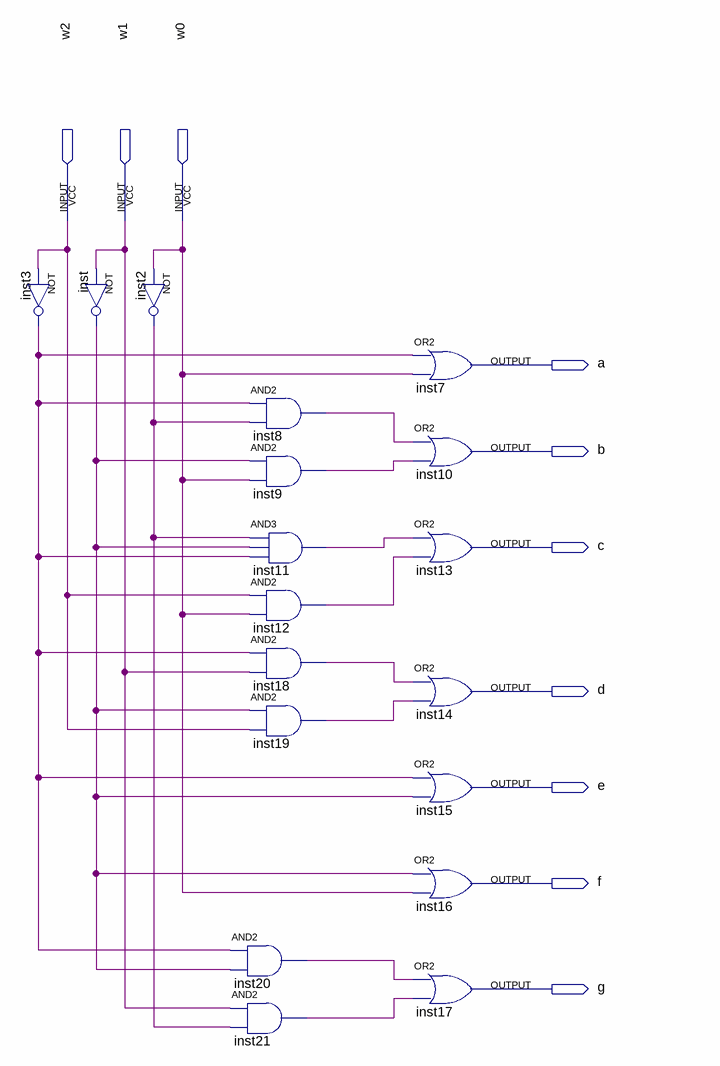
[diagram p0: schematic sheet]
// Quartus schematic WhatWonTo7Segment.bdf as structural Verilog: 18 symbols, 10 pins
module WhatWonTo7Segment (
  input  w2,
  input  w1,
  input  w0,
  output a,
  output b,
  output c,
  output d,
  output e,
  output f,
  output g
);

  wire inst2_out, inst3_out, inst8_out, inst9_out, inst11_out, inst12_out, inst18_out, inst19_out,
       inst20_out, inst21_out, inst_out;

  not inst3 (inst3_out, w2);
  not inst (inst_out, w1);
  not inst2 (inst2_out, w0);
  and inst8 (inst8_out, inst3_out, inst2_out);
  and inst9 (inst9_out, inst_out, w0);
  and inst11 (inst11_out, inst2_out, inst_out, inst3_out);
  and inst12 (inst12_out, w2, w0);
  and inst18 (inst18_out, inst3_out, w1);
  and inst19 (inst19_out, inst_out, w2);
  and inst20 (inst20_out, inst3_out, inst_out);
  and inst21 (inst21_out, w1, inst2_out);
  or inst7 (a, inst3_out, w0);
  or inst10 (b, inst8_out, inst9_out);
  or inst13 (c, inst11_out, inst12_out);
  or inst14 (d, inst18_out, inst19_out);
  or inst15 (e, inst3_out, inst_out);
  or inst16 (f, inst_out, w0);
  or inst17 (g, inst20_out, inst21_out);
endmodule
